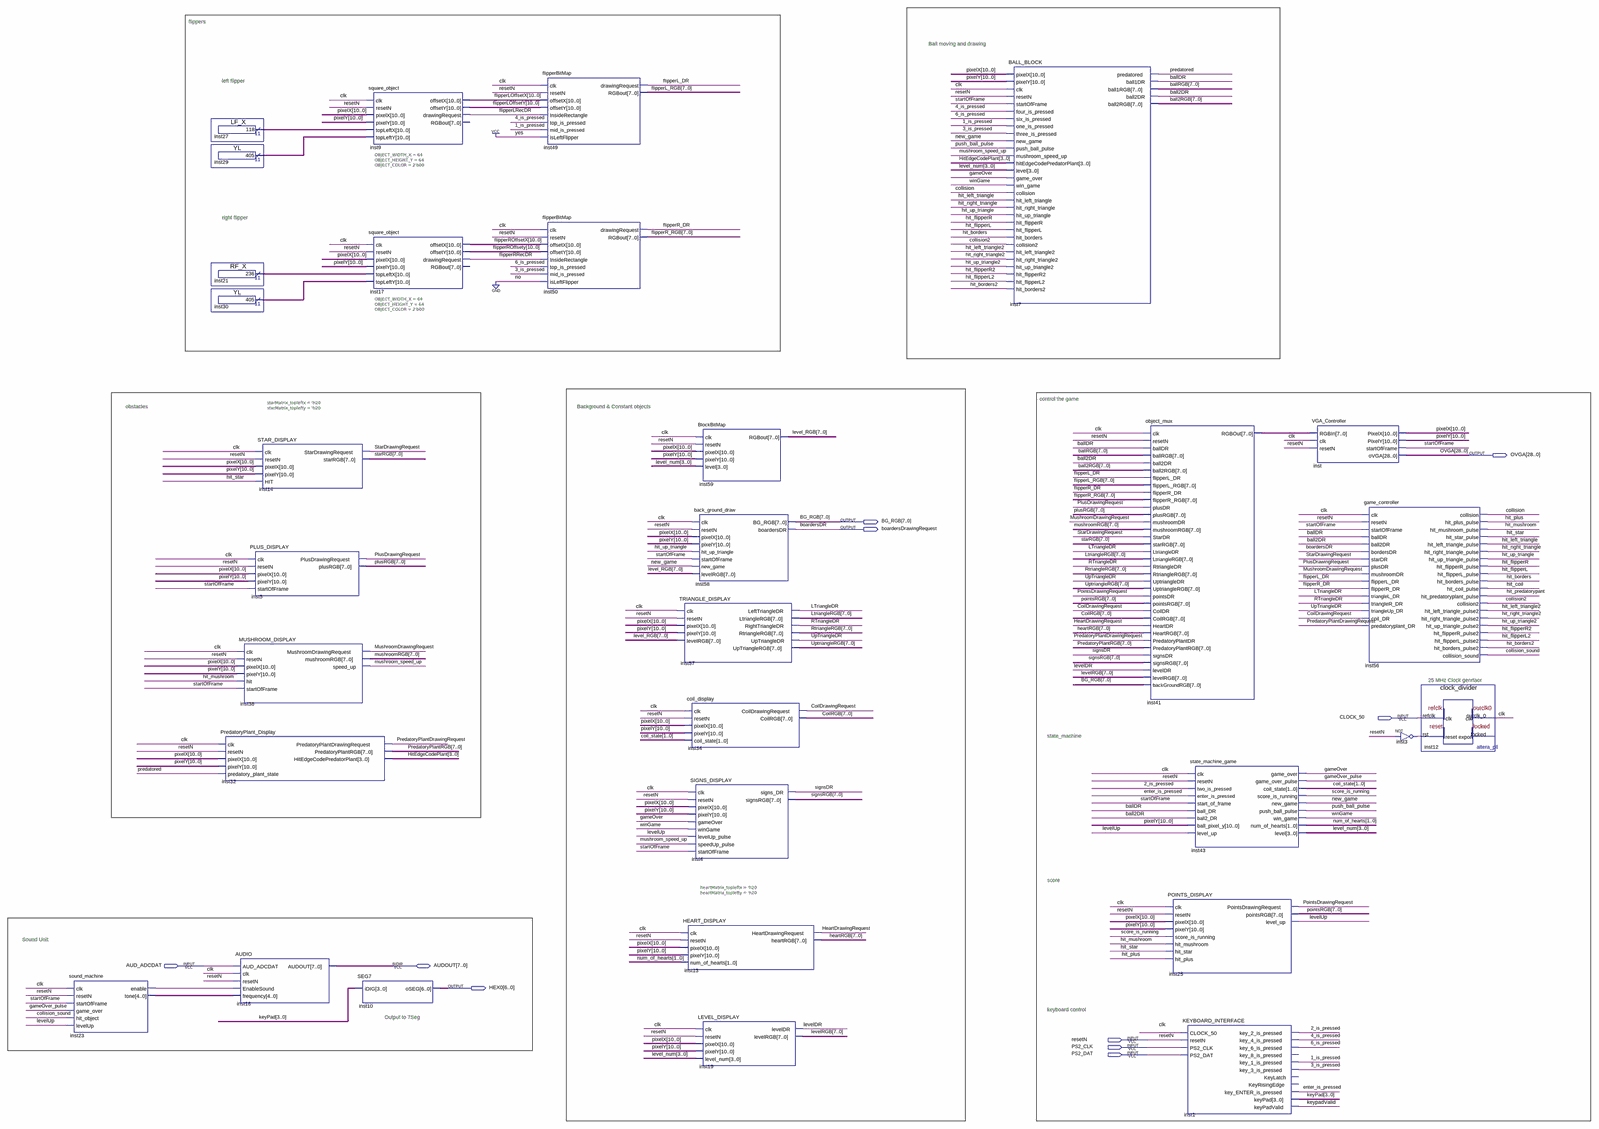
[diagram p0: schematic sheet, whole]
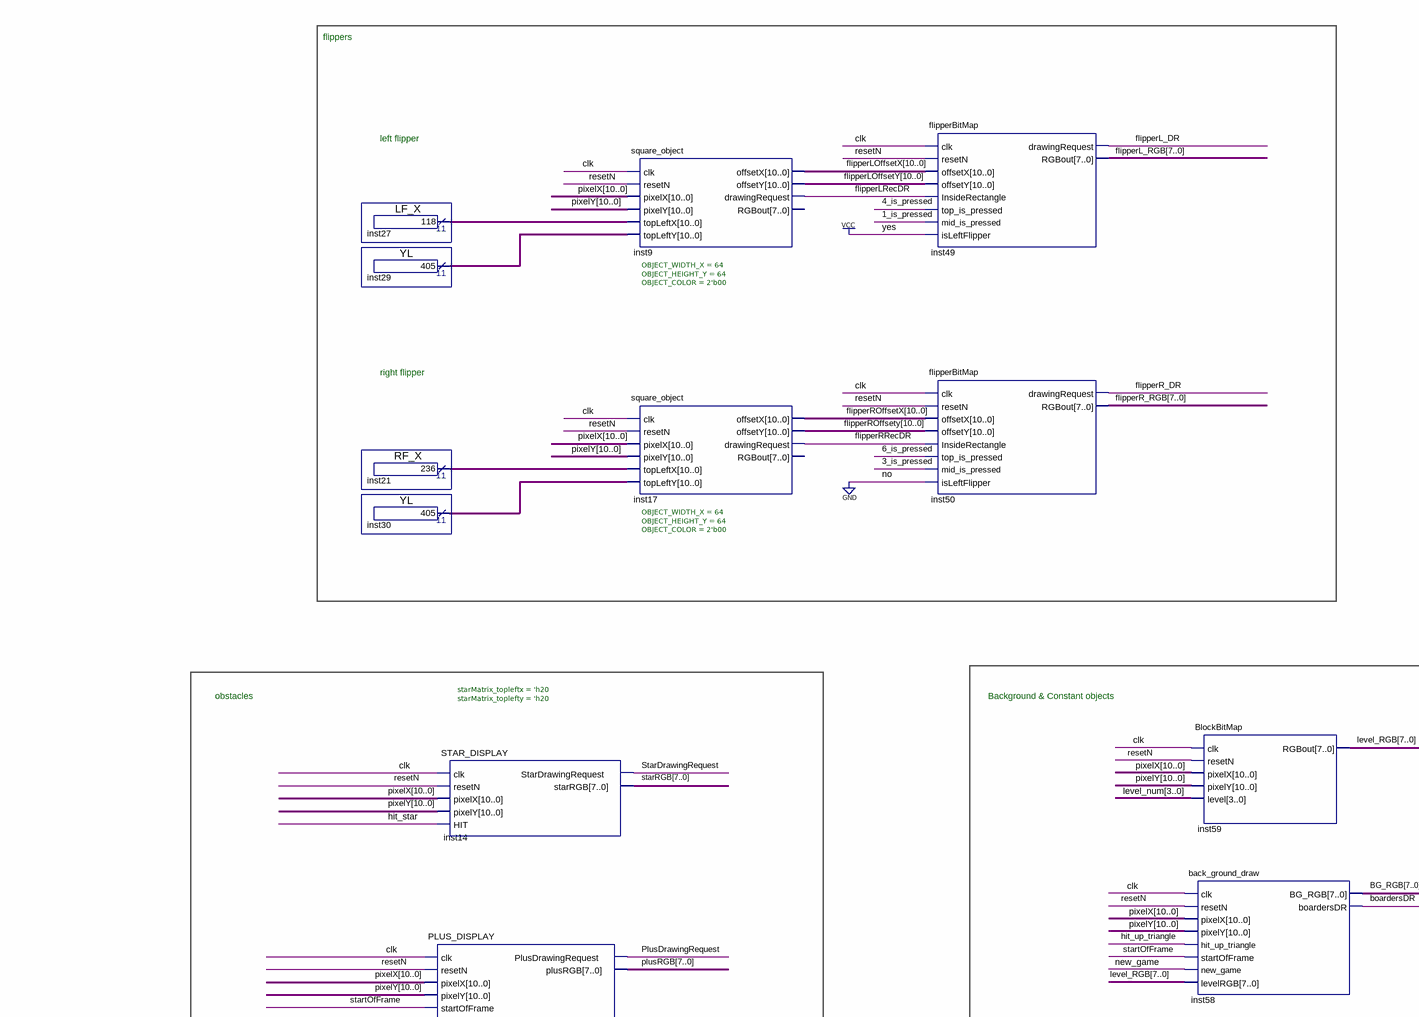
[diagram p1: schematic sheet, upper left part]
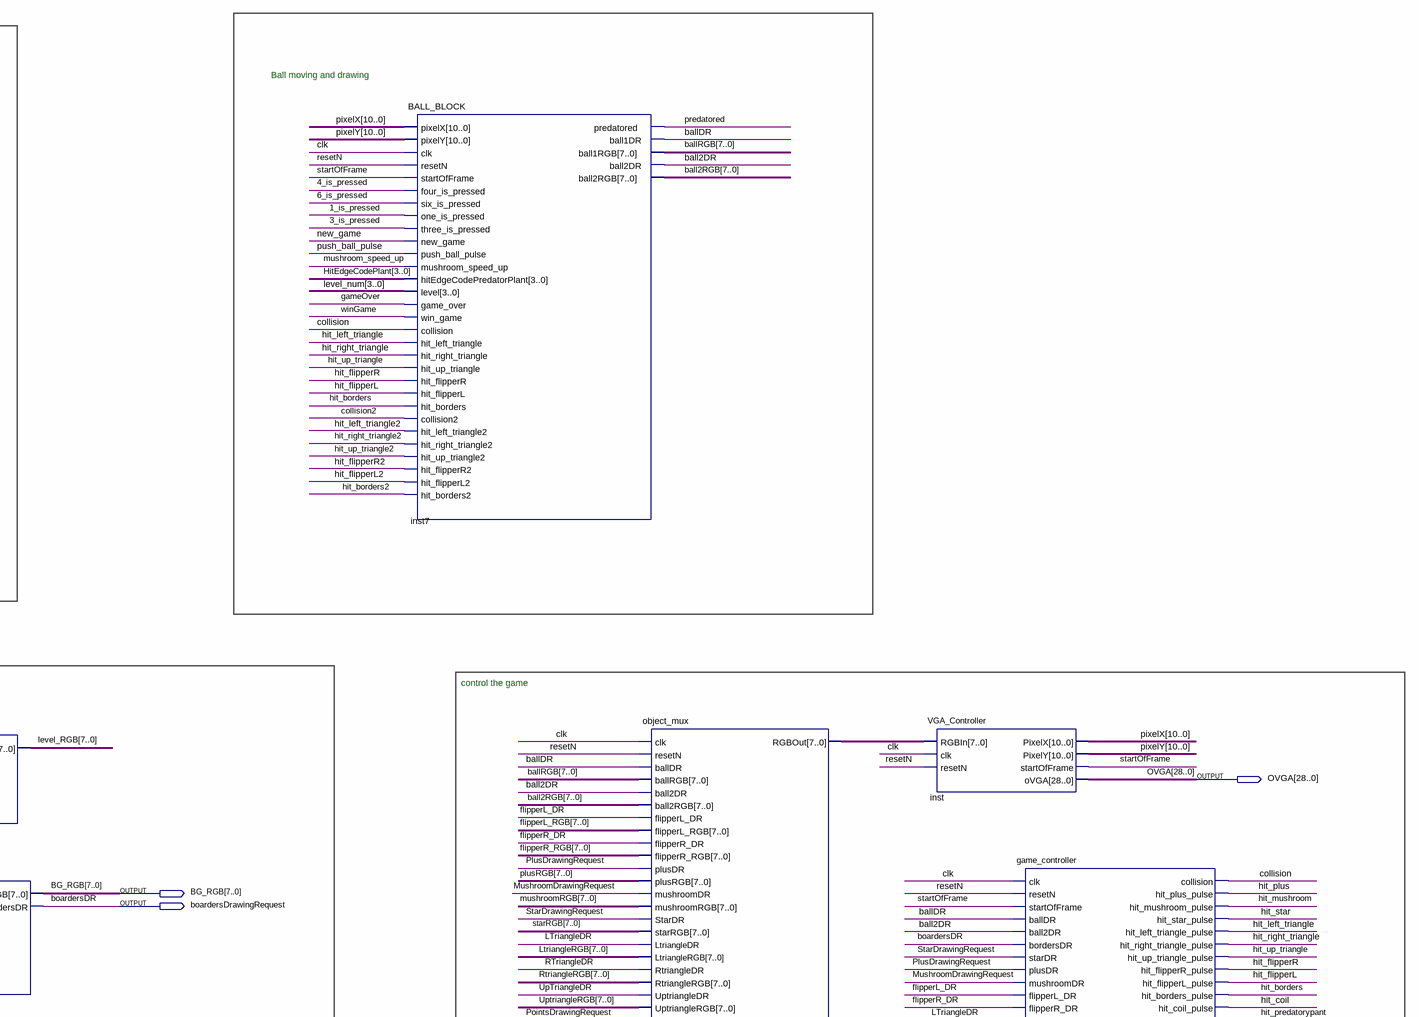
[diagram p2: schematic sheet, upper right part]
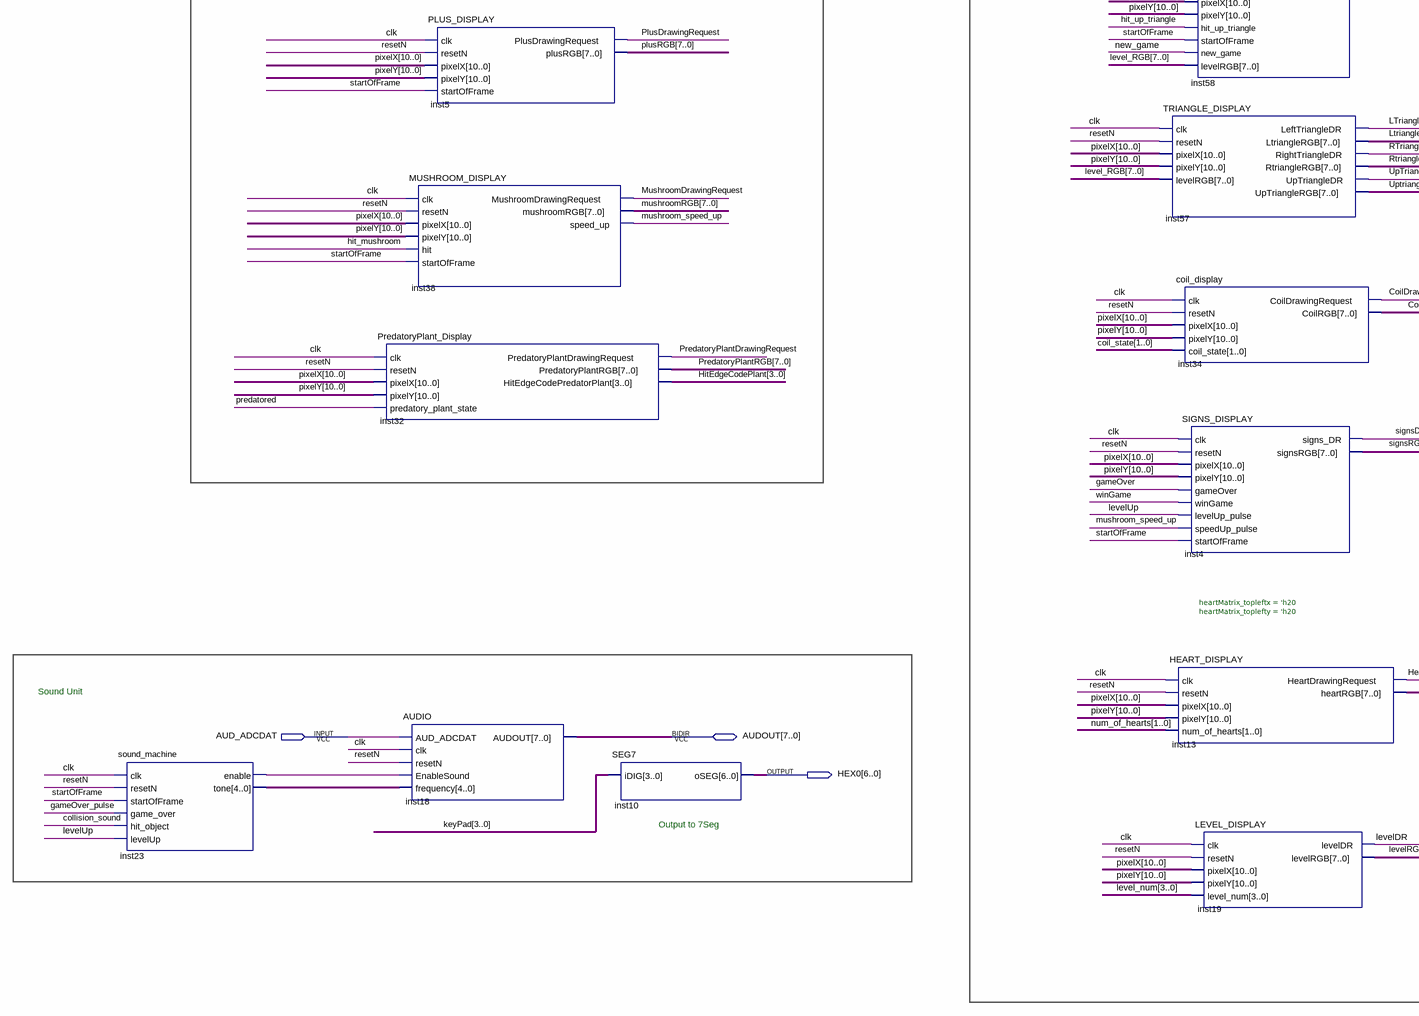
[diagram p3: schematic sheet, lower left part]
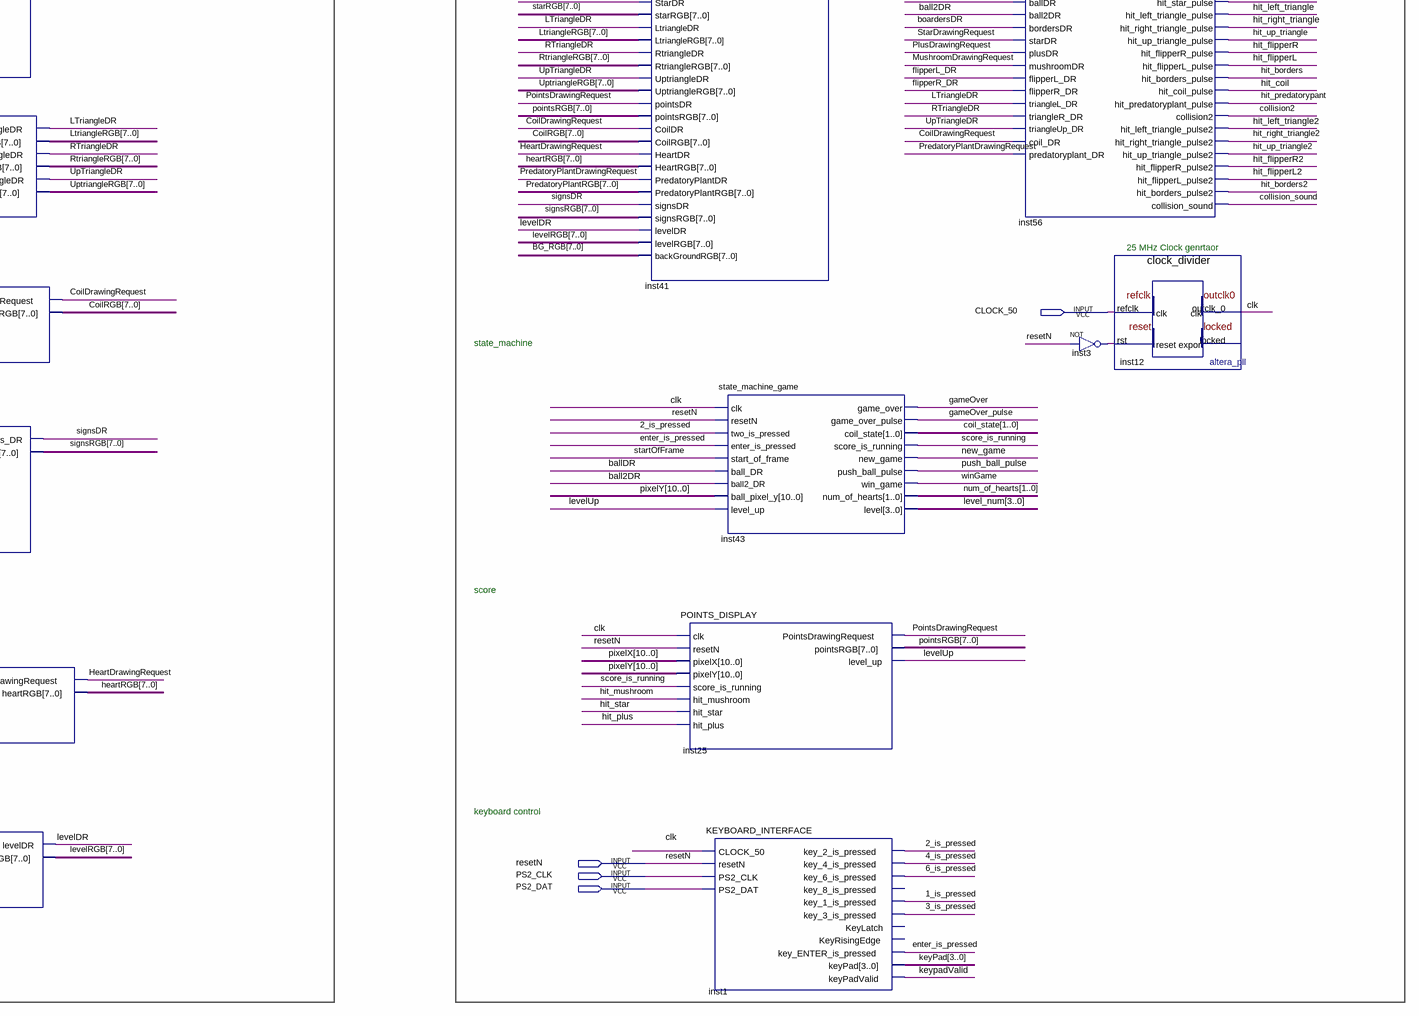
[diagram p4: schematic sheet, lower right part]
// Quartus schematic TOP_VGA_DEMO_KBD.bdf as structural Verilog: 31 symbols, 10 pins
module TOP_VGA_DEMO_KBD (
  input  CLOCK_50,
  input  AUD_ADCDAT,
  input  resetN,
  input  PS2_CLK,
  input  PS2_DAT,
  inout  [7:0] AUDOUT,
  output [28:0] OVGA,
  output [7:0] BG_RGB,
  output boardersDrawingRequest,
  output [6:0] HEX0
);

  wire \1_is_pressed , \2_is_pressed , \3_is_pressed , \4_is_pressed , \6_is_pressed , ball2DR, ballDR, clk,
       CoilDrawingRequest, collision, collision2, collision_sound, enter_is_pressed, flipperL_DR,
       flipperLRecDR, flipperR_DR, flipperRRecDR, gameOver, gameOver_pulse, HeartDrawingRequest, hit_borders,
       hit_borders2, hit_coil, hit_flipperL, hit_flipperL2, hit_flipperR, hit_flipperR2, hit_left_triangle,
       hit_left_triangle2, hit_mushroom, hit_plus, hit_predatorypant, hit_right_triangle,
       hit_right_triangle2, hit_star, hit_up_triangle, hit_up_triangle2, inst3_out, inst23_enable,
       keypadValid, levelDR, levelUp, LTriangleDR, mushroom_speed_up, MushroomDrawingRequest, new_game,
       PlusDrawingRequest, PointsDrawingRequest, predatored, PredatoryPlantDrawingRequest, push_ball_pulse,
       RTriangleDR, score_is_running, signsDR, StarDrawingRequest, startOfFrame, UpTriangleDR, winGame;
  wire [1:0] coil_state, num_of_hearts;
  wire [3:0] HitEdgeCodePlant, keyPad, level_num;
  wire [4:0] inst23_tone;
  wire [7:0] ball2RGB, ballRGB, CoilRGB, flipperL_RGB, flipperR_RGB, heartRGB, inst41_rgbout, level_RGB,
       levelRGB, LtriangleRGB, mushroomRGB, plusRGB, pointsRGB, PredatoryPlantRGB, RtriangleRGB, signsRGB,
       starRGB, UptriangleRGB;
  wire [10:0] flipperLOffsetX, flipperLOffsetY, flipperROffsetX, flipperROffsety, inst21_result,
       inst27_result, inst29_result, inst30_result, pixelX, pixelY;

  sound_machine inst23 (
    .clk(clk), .resetN(resetN), .startOfFrame(startOfFrame), .game_over(gameOver_pulse),
    .hit_object(collision_sound), .levelUp(levelUp), .enable(inst23_enable), .tone(inst23_tone));
  LF_X inst27 (.result(inst27_result));
  YL inst29 (.result(inst29_result));
  RF_X inst21 (.result(inst21_result));
  YL inst30 (.result(inst30_result));
  PredatoryPlant_Display inst32 (
    .clk(clk), .resetN(resetN), .pixelX(pixelX), .pixelY(pixelY), .predatory_plant_state(predatored),
    .PredatoryPlantDrawingRequest(PredatoryPlantDrawingRequest), .PredatoryPlantRGB(PredatoryPlantRGB),
    .HitEdgeCodePredatorPlant(HitEdgeCodePlant));
  STAR_DISPLAY #(.starMatrix_topleftx('h20), .starMatrix_toplefty('h20)) inst14 (
    .clk(clk), .resetN(resetN), .pixelX(pixelX), .pixelY(pixelY), .HIT(hit_star),
    .StarDrawingRequest(StarDrawingRequest), .starRGB(starRGB));
  PLUS_DISPLAY inst5 (
    .clk(clk), .resetN(resetN), .pixelX(pixelX), .pixelY(pixelY), .startOfFrame(startOfFrame),
    .PlusDrawingRequest(PlusDrawingRequest), .plusRGB(plusRGB));
  MUSHROOM_DISPLAY inst38 (
    .clk(clk), .resetN(resetN), .pixelX(pixelX), .pixelY(pixelY), .hit(hit_mushroom),
    .startOfFrame(startOfFrame), .MushroomDrawingRequest(MushroomDrawingRequest), .mushroomRGB(mushroomRGB),
    .speed_up(mushroom_speed_up));
  AUDIO inst18 (
    .AUD_ADCDAT(AUD_ADCDAT), .clk(clk), .resetN(resetN), .EnableSound(inst23_enable),
    .frequency(inst23_tone), .AUDOUT(AUDOUT));
  square_object #(.OBJECT_WIDTH_X(64), .OBJECT_HEIGHT_Y(64), .OBJECT_COLOR(2'b00)) inst9 (
    .clk(clk), .resetN(resetN), .pixelX(pixelX), .pixelY(pixelY), .topLeftX(inst27_result),
    .topLeftY(inst29_result), .offsetX(flipperLOffsetX), .offsetY(flipperLOffsetY),
    .drawingRequest(flipperLRecDR));  // open: RGBout
  square_object #(.OBJECT_WIDTH_X(64), .OBJECT_HEIGHT_Y(64), .OBJECT_COLOR(2'b00)) inst17 (
    .clk(clk), .resetN(resetN), .pixelX(pixelX), .pixelY(pixelY), .topLeftX(inst21_result),
    .topLeftY(inst30_result), .offsetX(flipperROffsetX), .offsetY(flipperROffsety),
    .drawingRequest(flipperRRecDR));  // open: RGBout
  SEG7 inst10 (.iDIG(keyPad), .oSEG(HEX0));
  flipperBitMap inst49 (
    .clk(clk), .resetN(resetN), .offsetX(flipperLOffsetX), .offsetY(flipperLOffsetY),
    .InsideRectangle(flipperLRecDR), .top_is_pressed(\4_is_pressed ), .mid_is_pressed(\1_is_pressed ),
    .isLeftFlipper(1'b1), .drawingRequest(flipperL_DR), .RGBout(flipperL_RGB));
  flipperBitMap inst50 (
    .clk(clk), .resetN(resetN), .offsetX(flipperROffsetX), .offsetY(flipperROffsety),
    .InsideRectangle(flipperRRecDR), .top_is_pressed(\6_is_pressed ), .mid_is_pressed(\3_is_pressed ),
    .isLeftFlipper(1'b0), .drawingRequest(flipperR_DR), .RGBout(flipperR_RGB));
  BlockBitMap inst59 (
    .clk(clk), .resetN(resetN), .pixelX(pixelX), .pixelY(pixelY), .level(level_num), .RGBout(level_RGB));
  back_ground_draw inst58 (
    .clk(clk), .resetN(resetN), .pixelX(pixelX), .pixelY(pixelY), .hit_up_triangle(hit_up_triangle),
    .startOfFrame(startOfFrame), .new_game(new_game), .levelRGB(level_RGB), .BG_RGB(BG_RGB),
    .boardersDR(boardersDrawingRequest));
  TRIANGLE_DISPLAY inst57 (
    .clk(clk), .resetN(resetN), .pixelX(pixelX), .pixelY(pixelY), .levelRGB(level_RGB),
    .LeftTriangleDR(LTriangleDR), .LtriangleRGB(LtriangleRGB), .RightTriangleDR(RTriangleDR),
    .RtriangleRGB(RtriangleRGB), .UpTriangleDR(UpTriangleDR), .UpTriangleRGB(UptriangleRGB));
  coil_display inst34 (
    .clk(clk), .resetN(resetN), .pixelX(pixelX), .pixelY(pixelY), .coil_state(coil_state),
    .CoilDrawingRequest(CoilDrawingRequest), .CoilRGB(CoilRGB));
  SIGNS_DISPLAY inst4 (
    .clk(clk), .resetN(resetN), .pixelX(pixelX), .pixelY(pixelY), .gameOver(gameOver), .winGame(winGame),
    .levelUp_pulse(levelUp), .speedUp_pulse(mushroom_speed_up), .startOfFrame(startOfFrame),
    .signs_DR(signsDR), .signsRGB(signsRGB));
  HEART_DISPLAY #(.heartMatrix_topleftx('h20), .heartMatrix_toplefty('h20)) inst13 (
    .clk(clk), .resetN(resetN), .pixelX(pixelX), .pixelY(pixelY), .num_of_hearts(num_of_hearts),
    .HeartDrawingRequest(HeartDrawingRequest), .heartRGB(heartRGB));
  LEVEL_DISPLAY inst19 (
    .clk(clk), .resetN(resetN), .pixelX(pixelX), .pixelY(pixelY), .level_num(level_num), .levelDR(levelDR),
    .levelRGB(levelRGB));
  BALL_BLOCK inst7 (
    .pixelX(pixelX), .pixelY(pixelY), .clk(clk), .resetN(resetN), .startOfFrame(startOfFrame),
    .four_is_pressed(\4_is_pressed ), .six_is_pressed(\6_is_pressed ), .one_is_pressed(\1_is_pressed ),
    .three_is_pressed(\3_is_pressed ), .new_game(new_game), .push_ball_pulse(push_ball_pulse),
    .mushroom_speed_up(mushroom_speed_up), .hitEdgeCodePredatorPlant(HitEdgeCodePlant), .level(level_num),
    .game_over(gameOver), .win_game(winGame), .collision(collision), .hit_left_triangle(hit_left_triangle),
    .hit_right_triangle(hit_right_triangle), .hit_up_triangle(hit_up_triangle), .hit_flipperR(hit_flipperR),
    .hit_flipperL(hit_flipperL), .hit_borders(hit_borders), .collision2(collision2),
    .hit_left_triangle2(hit_left_triangle2), .hit_right_triangle2(hit_right_triangle2),
    .hit_up_triangle2(hit_up_triangle2), .hit_flipperR2(hit_flipperR2), .hit_flipperL2(hit_flipperL2),
    .hit_borders2(hit_borders2), .predatored(predatored), .ball1DR(ballDR), .ball1RGB(ballRGB),
    .ball2DR(ball2DR), .ball2RGB(ball2RGB));
  object_mux inst41 (
    .clk(clk), .resetN(resetN), .ballDR(ballDR), .ballRGB(ballRGB), .ball2DR(ball2DR), .ball2RGB(ball2RGB),
    .flipperL_DR(flipperL_DR), .flipperL_RGB(flipperL_RGB), .flipperR_DR(flipperR_DR),
    .flipperR_RGB(flipperR_RGB), .plusDR(PlusDrawingRequest), .plusRGB(plusRGB),
    .mushroomDR(MushroomDrawingRequest), .mushroomRGB(mushroomRGB), .StarDR(StarDrawingRequest),
    .starRGB(starRGB), .LtriangleDR(LTriangleDR), .LtriangleRGB(LtriangleRGB), .RtriangleDR(RTriangleDR),
    .RtriangleRGB(RtriangleRGB), .UptriangleDR(UpTriangleDR), .UptriangleRGB(UptriangleRGB),
    .pointsDR(PointsDrawingRequest), .pointsRGB(pointsRGB), .CoilDR(CoilDrawingRequest), .CoilRGB(CoilRGB),
    .HeartDR(HeartDrawingRequest), .HeartRGB(heartRGB), .PredatoryPlantDR(PredatoryPlantDrawingRequest),
    .PredatoryPlantRGB(PredatoryPlantRGB), .signsDR(signsDR), .signsRGB(signsRGB), .levelDR(levelDR),
    .levelRGB(levelRGB), .backGroundRGB(BG_RGB), .RGBOut(inst41_rgbout));
  POINTS_DISPLAY inst25 (
    .clk(clk), .resetN(resetN), .pixelX(pixelX), .pixelY(pixelY), .score_is_running(score_is_running),
    .hit_mushroom(hit_mushroom), .hit_star(hit_star), .hit_plus(hit_plus),
    .PointsDrawingRequest(PointsDrawingRequest), .pointsRGB(pointsRGB), .level_up(levelUp));
  state_machine_game inst43 (
    .clk(clk), .resetN(resetN), .two_is_pressed(\2_is_pressed ), .enter_is_pressed(enter_is_pressed),
    .start_of_frame(startOfFrame), .ball_DR(ballDR), .ball2_DR(ball2DR), .ball_pixel_y(pixelY),
    .level_up(levelUp), .game_over(gameOver), .game_over_pulse(gameOver_pulse), .coil_state(coil_state),
    .score_is_running(score_is_running), .new_game(new_game), .push_ball_pulse(push_ball_pulse),
    .win_game(winGame), .num_of_hearts(num_of_hearts), .level(level_num));
  KEYBOARD_INTERFACE inst1 (
    .CLOCK_50(clk), .resetN(resetN), .PS2_CLK(PS2_CLK), .PS2_DAT(PS2_DAT), .key_2_is_pressed(\2_is_pressed ),
    .key_4_is_pressed(\4_is_pressed ), .key_6_is_pressed(\6_is_pressed ), .key_1_is_pressed(\1_is_pressed ),
    .key_3_is_pressed(\3_is_pressed ), .key_ENTER_is_pressed(enter_is_pressed), .keyPad(keyPad),
    .keyPadValid(keypadValid));  // open: key_8_is_pressed, KeyLatch, KeyRisingEdge
  VGA_Controller inst (
    .RGBIn(inst41_rgbout), .clk(clk), .resetN(resetN), .PixelX(pixelX), .PixelY(pixelY),
    .startOfFrame(startOfFrame), .oVGA(OVGA));
  game_controller inst56 (
    .clk(clk), .resetN(resetN), .startOfFrame(startOfFrame), .ballDR(ballDR), .ball2DR(ball2DR),
    .bordersDR(boardersDrawingRequest), .starDR(StarDrawingRequest), .plusDR(PlusDrawingRequest),
    .mushroomDR(MushroomDrawingRequest), .flipperL_DR(flipperL_DR), .flipperR_DR(flipperR_DR),
    .triangleL_DR(LTriangleDR), .triangleR_DR(RTriangleDR), .triangleUp_DR(UpTriangleDR),
    .coil_DR(CoilDrawingRequest), .predatoryplant_DR(PredatoryPlantDrawingRequest), .collision(collision),
    .hit_plus_pulse(hit_plus), .hit_mushroom_pulse(hit_mushroom), .hit_star_pulse(hit_star),
    .hit_left_triangle_pulse(hit_left_triangle), .hit_right_triangle_pulse(hit_right_triangle),
    .hit_up_triangle_pulse(hit_up_triangle), .hit_flipperR_pulse(hit_flipperR),
    .hit_flipperL_pulse(hit_flipperL), .hit_borders_pulse(hit_borders), .hit_coil_pulse(hit_coil),
    .hit_predatoryplant_pulse(hit_predatorypant), .collision2(collision2),
    .hit_left_triangle_pulse2(hit_left_triangle2), .hit_right_triangle_pulse2(hit_right_triangle2),
    .hit_up_triangle_pulse2(hit_up_triangle2), .hit_flipperR_pulse2(hit_flipperR2),
    .hit_flipperL_pulse2(hit_flipperL2), .hit_borders_pulse2(hit_borders2), .collision_sound(collision_sound));
  not inst3 (inst3_out, resetN);
  clock_divider inst12 (.refclk(CLOCK_50), .rst(inst3_out), .outclk_0(clk));  // open: locked

  // Other names for the same wires on the sheet: boardersDR = boardersDrawingRequest

  // Notes on the sheet:
  //   flippers
  //   Ball moving and drawing
  //   left flipper
  //   right flipper
  //   control the game
  //   obstacles
  //   Background & Constant objects
  //   25 MHz Clock genrtaor
  //   state_machine
  //   score
  //   Sound Unit
  //   keyboard control
  //   Output to 7Seg
endmodule
